# EAGLE design signalgen (EAGLE 8.3.2)
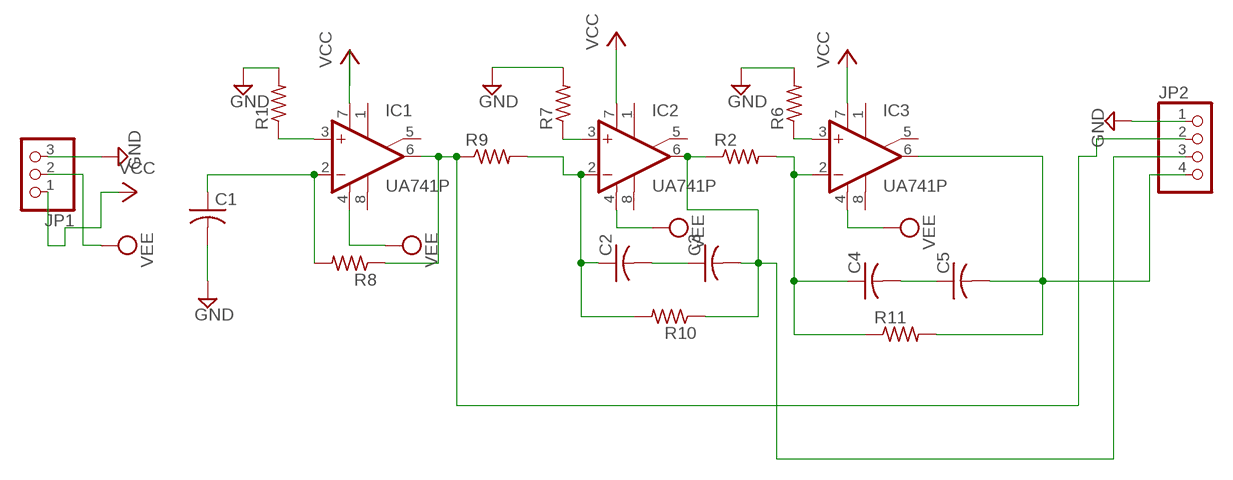
[diagram p0: schematic, sheet 1]

## Parts
C1  C-US050-024X044  [C050-024X044]
C2  C-US050-024X044  [C050-024X044]
C3  C-US050-024X044  [C050-024X044]
C4  C-US050-024X044  [C050-024X044]
C5  C-US050-024X044  [C050-024X044]
IC1  UA741P  [DIL08]
IC2  UA741P  [DIL08]
IC3  UA741P  [DIL08]
JP1  PINHD-1X3  [1X03]
JP2  PINHD-1X4  [1X04]
R1  R-US_0207/10  [0207/10]
R2  R-US_0207/10  [0207/10]
R6  R-US_0207/10  [0207/10]
R7  R-US_0207/10  [0207/10]
R8  R-US_0207/10  [0207/10]
R9  R-US_0207/10  [0207/10]
R10  R-US_0207/10  [0207/10]
R11  R-US_0207/10  [0207/10]

## Nets
GND: C1.2 JP1.3 JP2.1 R1.2 R6.2 R7.2
N$1: C1.1 IC1.2(-IN) R8.2
N$2: IC1.6(OUT) JP2.2 R8.1 R9.1
N$3: C2.1 IC2.2(-IN) R9.2 R10.2
N$4: C4.2 C5.1
N$5: C2.2 C3.1
N$6: C3.2 IC2.6(OUT) JP2.3 R2.1 R10.1
N$7: C4.1 IC3.2(-IN) R2.2 R11.1
N$8: IC1.3(+IN) R1.1
N$9: IC2.3(+IN) R7.1
N$10: IC3.3(+IN) R6.1
N$11: C5.2 IC3.6(OUT) JP2.4 R11.2
VCC: IC1.7(V+) IC2.7(V+) IC3.7(V+) JP1.1
VEE: IC1.4(V-) IC2.4(V-) IC3.4(V-) JP1.2
Unconnected: IC1.1(ON1) IC1.5(ON2) IC1.8(OPT) IC2.1(ON1) IC2.5(ON2) IC2.8(OPT) IC3.1(ON1) IC3.5(ON2) IC3.8(OPT)

## Library data of the parts
C1-C5 = adafruit:C-US: CAPACITOR, American symbol
IC1-IC3 = linear:*741: OP AMP
JP1 = pinhead:PINHD-1X3: PIN HEADER
JP2 = pinhead:PINHD-1X4: PIN HEADER
R1 R2 R6-R11 = rcl:R-US_: RESISTOR, American symbol

## Board
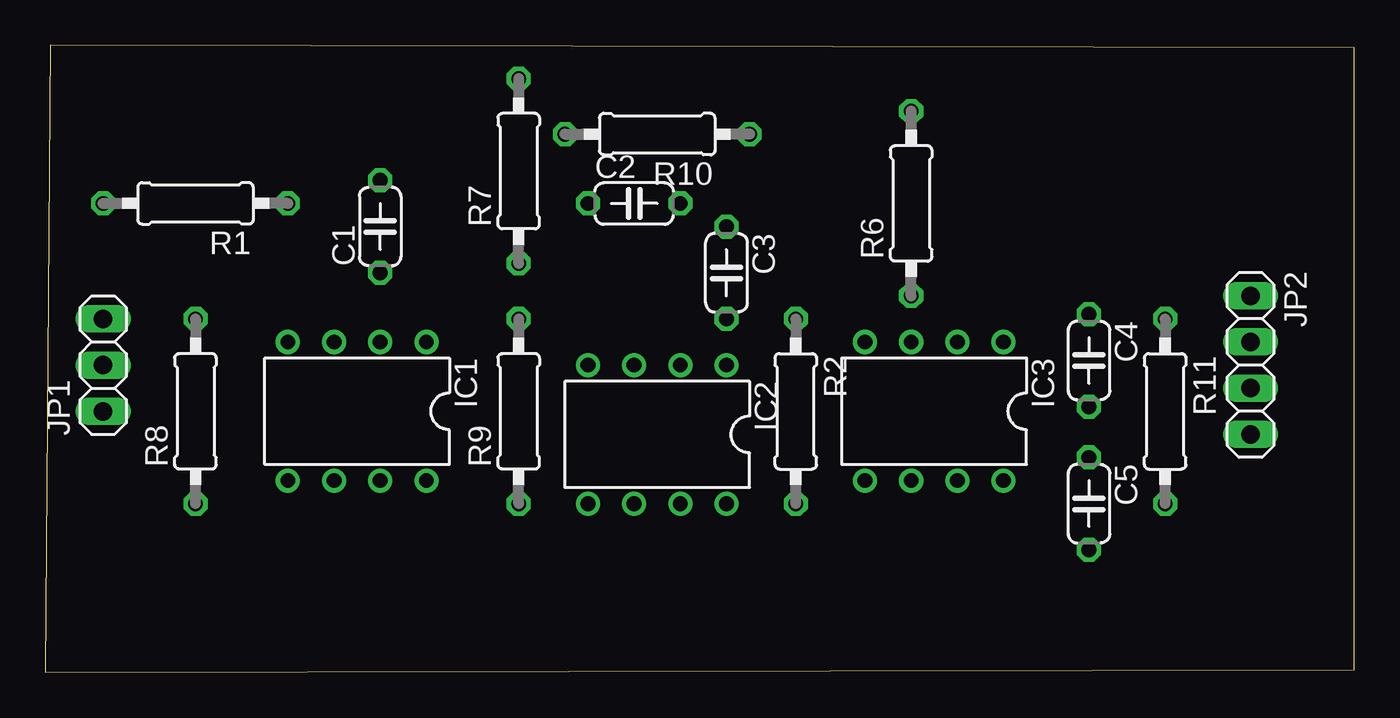
[diagram p1: board, top side]
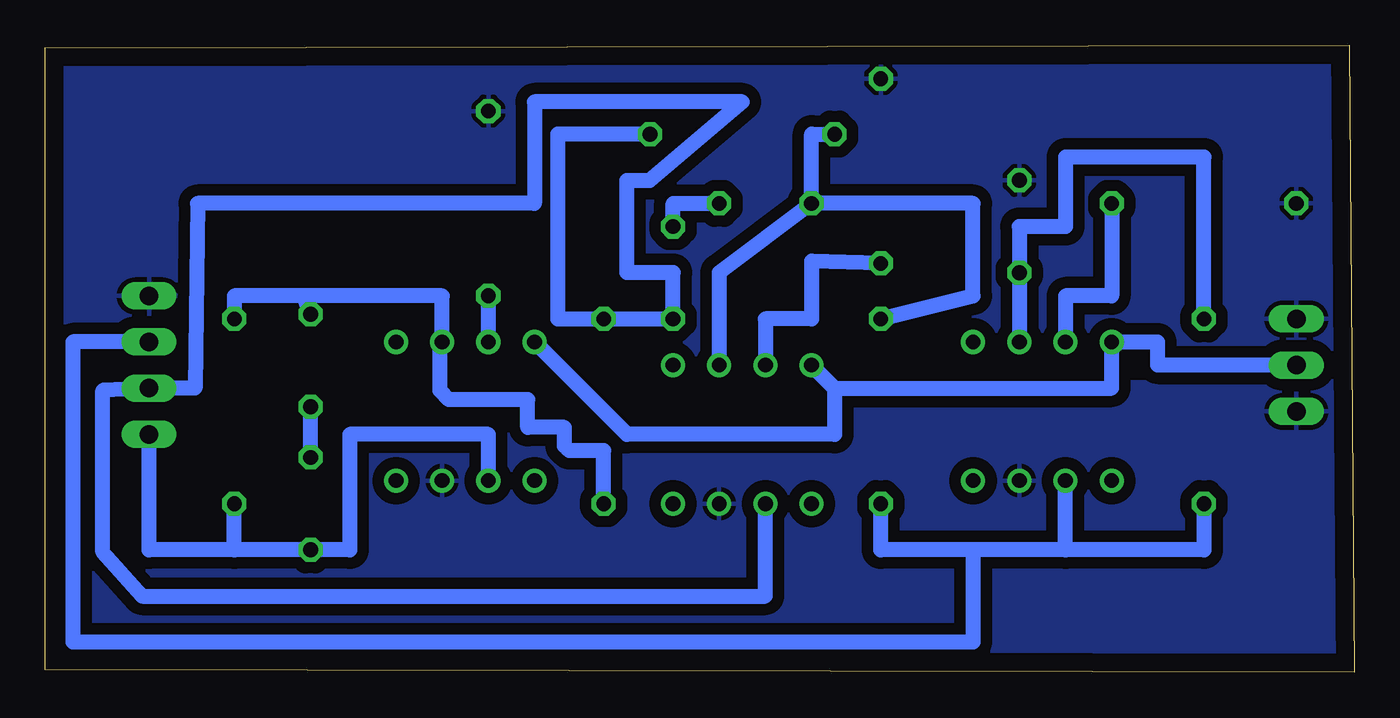
[diagram p2: board, bottom side, seen from below]

Size 71.99 x 34.47 mm. Coordinates in mm from the lower left corner, seen from the top.
Outline: 0,0 71.99,0.13 71.99,34.34 0.25,34.47 0,0
Copper layers (1*16): Top 0.035mm / dielectric 1.5mm / Bottom 0.035mm
Design rules "default *": minimum track width 6mil, minimum drill 0.35mm, track to track 25mil, track to pad 20mil, pad to pad 6mil, via to via 6mil, smd to smd 6mil, copper to edge 40mil, drill to drill 6mil, minimum pad ring 10mil, minimum via ring 8mil, stop-mask expansion 4mil, vias tented up to drill 0mil, thermal gap 10mil

### Footprints (pad centres in the part's own frame; a part is rotated, then mirrored left to right if it is on the bottom)
C050-024X044 = drill 0.813 octagon: 1 -2.54,0; 2 2.54,0
DIL08 = drill 0.813 pad 1.27: 1 -3.81,-3.81; 2 -1.27,-3.81; 3 1.27,-3.81; 4 3.81,-3.81; 5 3.81,3.81; 6 1.27,3.81; 7 -1.27,3.81; 8 -3.81,3.81
1X03 = drill 1.016 long: 1 -2.54,0; 2 0,0; 3 2.54,0
1X04 = drill 1.016 long: 1 -3.81,0; 2 -1.27,0; 3 1.27,0; 4 3.81,0
0207/10 = drill 0.813 octagon: 1 -5.08,0; 2 5.08,0

### Placement (x,y rotation side)
C1  18.41,24.51 90 top
C2  32.38,25.78 0 top
C3  37.47,21.97 270 top
C4  57.4,17.14 270 top
C5  57.4,9.27 270 top
IC1  17.15,14.35 180 top
IC2  33.66,13.08 180 top
IC3  48.9,14.35 180 top
JP1  3.17,16.89 90 top
JP2  66.29,16.89 270 top
R1  8.26,25.78 180 top
R2  41.27,14.35 270 top
R6  47.62,25.78 90 top
R7  26.04,27.56 90 top
R8  8.26,14.35 90 top
R9  26.04,14.35 90 top
R10  33.66,29.59 180 top
R11  61.6,14.35 270 top

### Tracks (layer width: path | path; a pad name or v marks a point on that pad's centre or on a via)
GND
  pour Bottom: 0.13,35.05 73.79,34.8 73.66,16.38 0.13,17.27
N$1
  Bottom 0.813: IC1.2 C1.1 18.41,24.51 15.87,24.51 15.87,28.32 8.26,28.32 R8.2
N$2
  Bottom 0.813: R8.1 8.26,6.73 15.87,6.73 | 15.87,6.73 IC1.6 | 15.87,6.73 20.95,6.73 | 20.95,6.73 20.95,1.65 70.48,1.65 70.48,18.16 JP2.2 | R9.1 26.04,6.73 20.95,6.73
N$3
  Bottom 0.813: C2.1 29.84,29.59 R10.2 | R9.2 20.95,20.7 20.95,25.78 C2.1 | C2.1 34.93,21.97 IC2.2
N$4
  Bottom 0.813: C5.1 C4.2
N$5
  Bottom 0.813: C3.1 37.47,25.78 C2.2
N$6
  Bottom 0.813: R10.1 43.82,29.59 43.82,19.43 R2.1 C3.2 37.47,21.97 40.01,21.97 40.01,27.05 38.73,27.05 33.66,31.37 45.09,31.37 45.09,25.78 63.63,25.78 63.75,15.62 JP2.3 68.83,15.49 68.83,6.6 66.67,4.19 32.38,4.19 IC2.6
N$7
  Bottom 0.813: C4.1 57.79,20.7 | 57.79,20.7 61.6,20.7 R11.1 | 57.79,20.7 50.16,20.7 IC3.2 50.29,18.03 50.29,15.49 49.78,14.99 45.47,14.99 45.47,13.46 43.43,13.46 43.43,12.45 43.18,12.19 41.27,12.19 R2.2
N$8
  Bottom 0.813: R1.1 13.33,20.7 15.87,20.7 IC1.3
N$9
  Bottom 0.813: R7.1 29.84,22.61 29.84,19.43 32.38,19.43 IC2.3
N$10
  Bottom 0.813: IC3.3 R6.1
N$11
  Bottom 0.813: 61.6,6.73 C5.2 55.24,6.73 55.24,13.08 47.62,13.08 IC3.6 | 61.6,6.73 R11.2 | 61.6,6.73 66.29,6.73 JP2.4
VCC
  pour Bottom: 0.38,16.26 72.77,14.61 72.52,0.13 0.38,-0.64
VEE
  Bottom 0.813: JP1.2 10.79,16.89 10.79,18.16 IC1.4 13.33,15.62 28.58,15.62 | IC2.4 28.58,15.62 | IC3.4 40.01,13.08 28.58,13.08 28.58,15.62